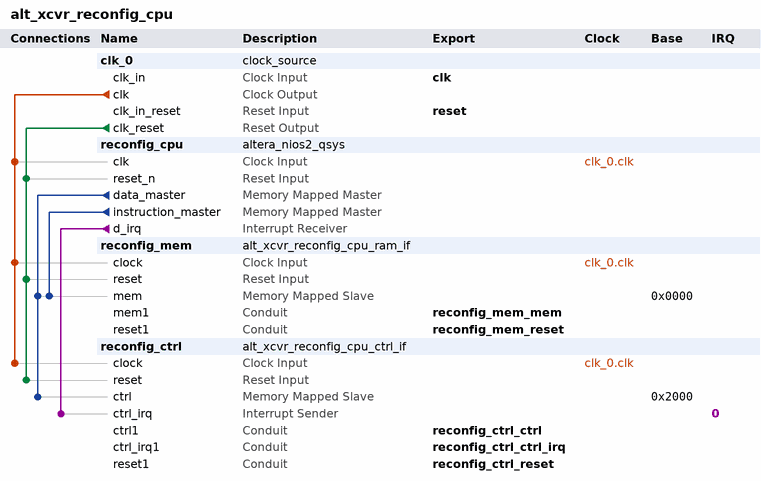
[diagram p0: system contents]
# Platform Designer (Qsys) system alt_xcvr_reconfig_cpu
# Parameters at their usual value, and those the tool derives, are not listed.
package require -exact qsys 12.0
create_system alt_xcvr_reconfig_cpu
set_project_property DEVICE_FAMILY {Stratix V}

add_instance clk_0 clock_source 12.0
set_instance_parameter_value clk_0 clockFrequency 100000000

add_instance reconfig_cpu altera_nios2_qsys 12.0
set_instance_parameter_value reconfig_cpu manuallyAssignCpuID false
set_instance_parameter_value reconfig_cpu resetSlave reconfig_mem.mem
set_instance_parameter_value reconfig_cpu exceptionSlave reconfig_mem.mem
set_instance_parameter_value reconfig_cpu breakSlave reconfig_mem.mem
set_instance_parameter_value reconfig_cpu muldiv_multiplierType DSPBlock
set_instance_parameter_value reconfig_cpu impl Tiny
set_instance_parameter_value reconfig_cpu icache_size 512
set_instance_parameter_value reconfig_cpu debug_level NoDebug
set_instance_parameter_value reconfig_cpu dcache_size 0

add_instance reconfig_mem alt_xcvr_reconfig_cpu_ram_if 11.0

add_instance reconfig_ctrl alt_xcvr_reconfig_cpu_ctrl_if 11.0

# connections
add_connection clk_0.clk reconfig_cpu.clk clock
add_connection clk_0.clk reconfig_ctrl.clock clock
add_connection clk_0.clk reconfig_mem.clock clock
add_connection clk_0.clk_reset reconfig_cpu.reset_n reset
add_connection clk_0.clk_reset reconfig_ctrl.reset reset
add_connection clk_0.clk_reset reconfig_mem.reset reset
add_connection reconfig_cpu.data_master reconfig_ctrl.ctrl avalon
set_connection_parameter_value reconfig_cpu.data_master/reconfig_ctrl.ctrl baseAddress 0x2000
add_connection reconfig_cpu.data_master reconfig_mem.mem avalon
set_connection_parameter_value reconfig_cpu.data_master/reconfig_mem.mem baseAddress 0x0000
add_connection reconfig_cpu.instruction_master reconfig_mem.mem avalon
set_connection_parameter_value reconfig_cpu.instruction_master/reconfig_mem.mem baseAddress 0x0000
add_connection reconfig_cpu.d_irq reconfig_ctrl.ctrl_irq interrupt
set_connection_parameter_value reconfig_cpu.d_irq/reconfig_ctrl.ctrl_irq irqNumber 0

# exported interfaces
add_interface clk clock sink
set_interface_property clk EXPORT_OF clk_0.clk_in
add_interface reset reset sink
set_interface_property reset EXPORT_OF clk_0.clk_in_reset
add_interface reconfig_mem_mem conduit end
set_interface_property reconfig_mem_mem EXPORT_OF reconfig_mem.mem1
add_interface reconfig_mem_reset conduit end
set_interface_property reconfig_mem_reset EXPORT_OF reconfig_mem.reset1
add_interface reconfig_ctrl_reset conduit end
set_interface_property reconfig_ctrl_reset EXPORT_OF reconfig_ctrl.reset1
add_interface reconfig_ctrl_ctrl conduit end
set_interface_property reconfig_ctrl_ctrl EXPORT_OF reconfig_ctrl.ctrl1
add_interface reconfig_ctrl_ctrl_irq conduit end
set_interface_property reconfig_ctrl_ctrl_irq EXPORT_OF reconfig_ctrl.ctrl_irq1

save_system alt_xcvr_reconfig_cpu.qsys
